# EAGLE schematic yacc1buss (EAGLE 7.5.0)
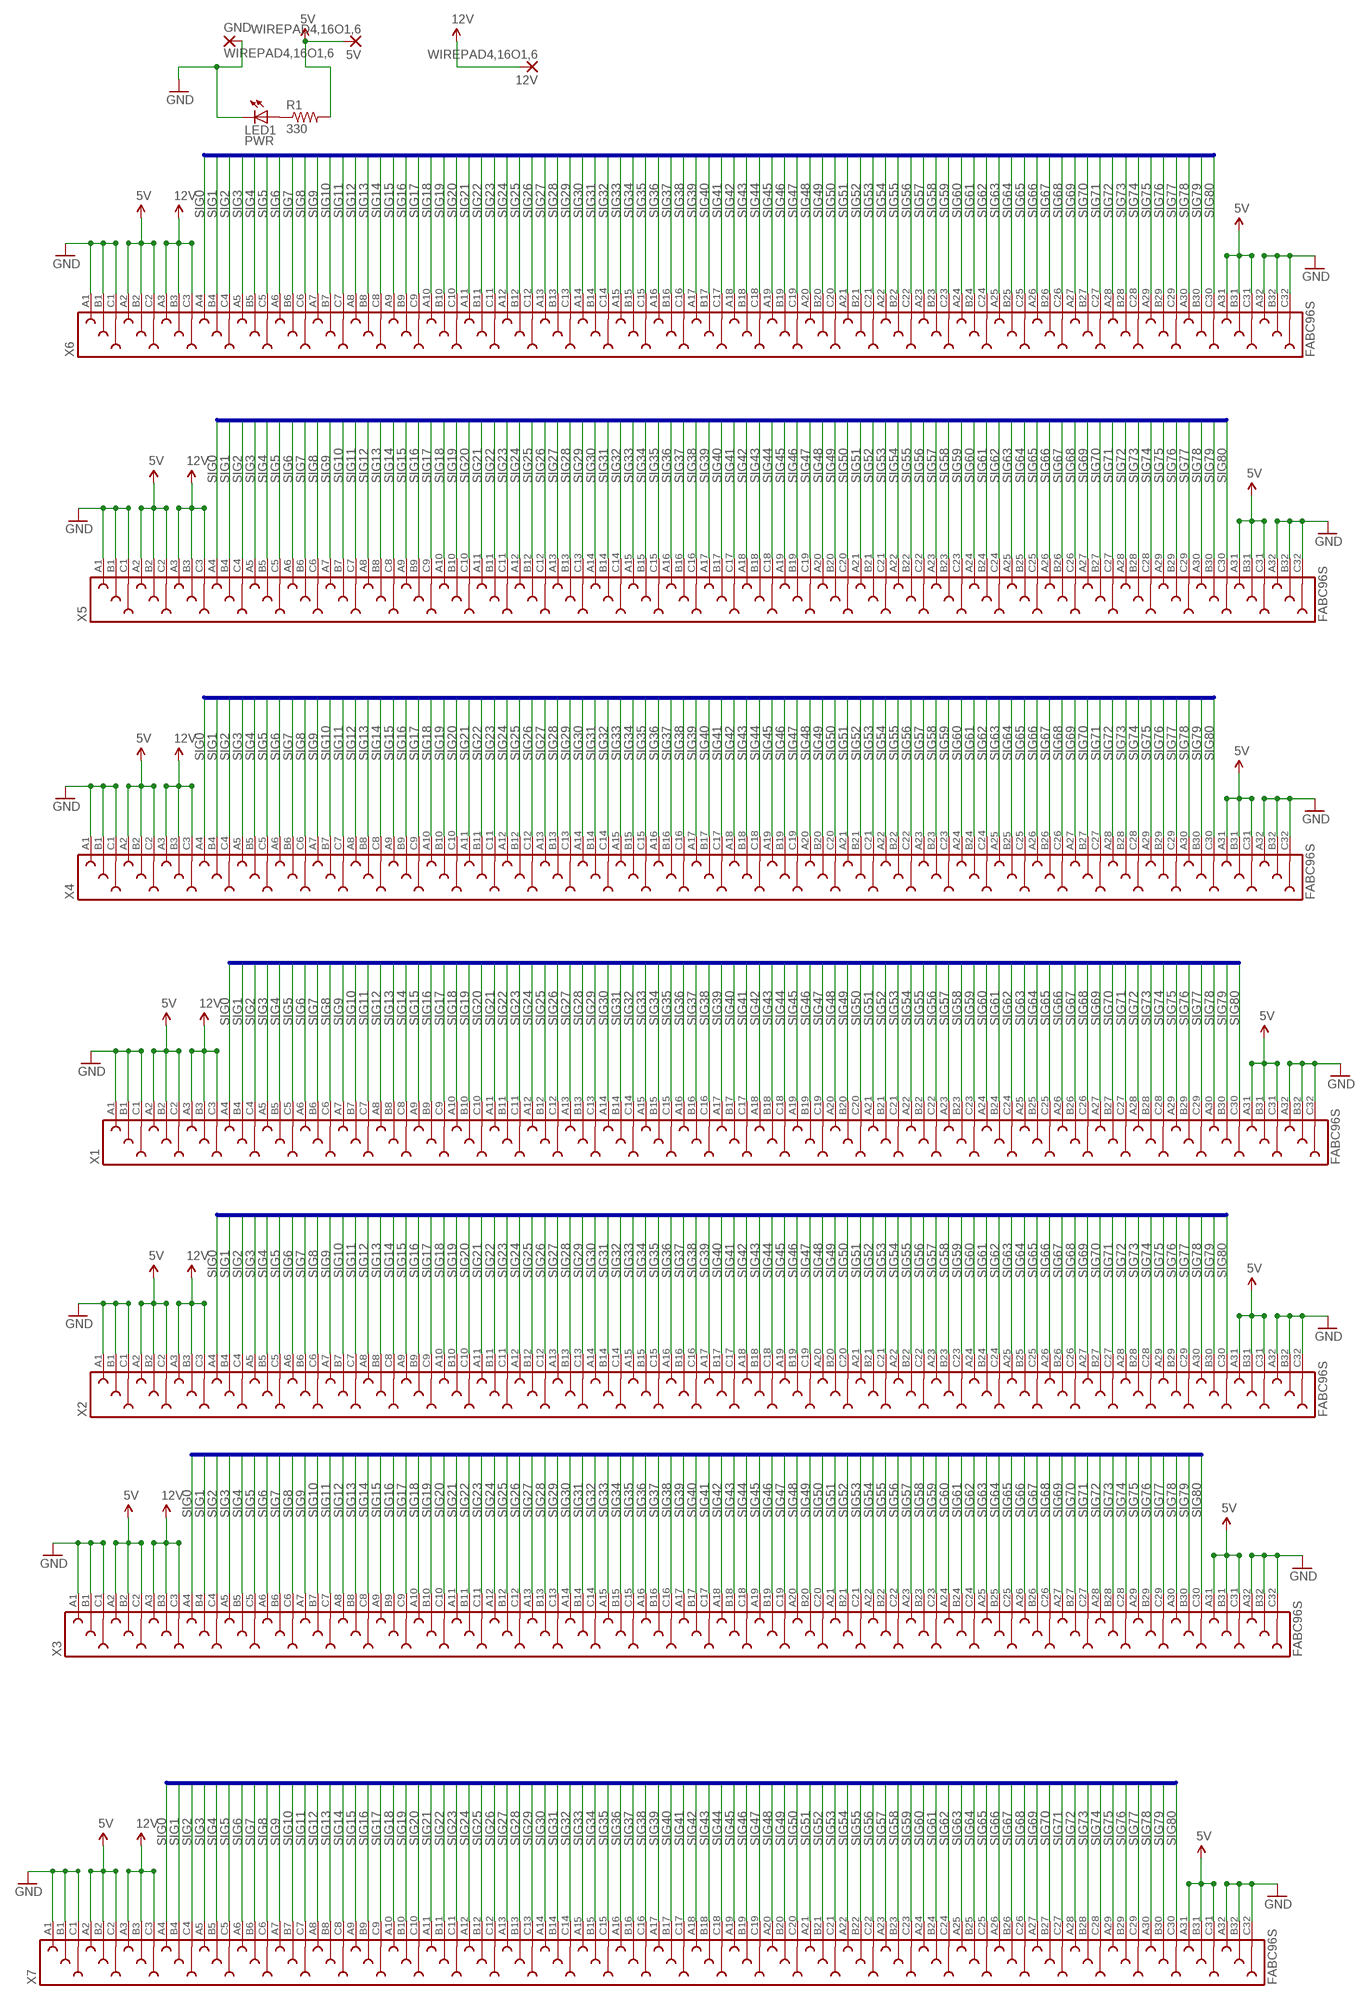
[diagram p0: schematic, sheet 1]

## Parts
5V  WIREPAD4,16O1,6  [4,16O1,6]
12V  WIREPAD4,16O1,6  [4,16O1,6]
GND  WIREPAD4,16O1,6  [4,16O1,6]
LED1  PWR  LED5MM  [LED5MM]
R1  330  R-US_0309/12  [0309/12]
X1  FABC96S  [FABC96S]
X2  FABC96S  [FABC96S]
X3  FABC96S  [FABC96S]
X4  FABC96S  [FABC96S]
X5  FABC96S  [FABC96S]
X6  FABC96S  [FABC96S]
X7  FABC96S  [FABC96S]

## Nets
5V [5V]: 5V.1(P) R1.2 X1.A2 X1.A31 X1.B2 X1.B31 X1.C2 X1.C31 X2.A2 X2.A31 X2.B2 X2.B31 X2.C2 X2.C31 X3.A2 X3.A31 X3.B2 X3.B31 X3.C2 X3.C31 X4.A2 X4.A31 X4.B2 X4.B31 X4.C2 X4.C31 X5.A2 X5.A31 X5.B2 X5.B31 X5.C2 X5.C31 X6.A2 X6.A31 X6.B2 X6.B31 X6.C2 X6.C31 X7.A2 X7.A31 X7.B2 X7.B31 X7.C2 X7.C31
12V [12V]: 12V.1(P) X1.A3 X1.B3 X1.C3 X2.A3 X2.B3 X2.C3 X3.A3 X3.B3 X3.C3 X4.A3 X4.B3 X4.C3 X5.A3 X5.B3 X5.C3 X6.A3 X6.B3 X6.C3 X7.A3 X7.B3 X7.C3
GND [GND]: GND.1(P) LED1.K(C) X1.A1 X1.A32 X1.B1 X1.B32 X1.C1 X1.C32 X2.A1 X2.A32 X2.B1 X2.B32 X2.C1 X2.C32 X3.A1 X3.A32 X3.B1 X3.B32 X3.C1 X3.C32 X4.A1 X4.A32 X4.B1 X4.B32 X4.C1 X4.C32 X5.A1 X5.A32 X5.B1 X5.B32 X5.C1 X5.C32 X6.A1 X6.A32 X6.B1 X6.B32 X6.C1 X6.C32 X7.A1 X7.A32 X7.B1 X7.B32 X7.C1 X7.C32
N$1: LED1.A R1.1
SIG0: X1.A4 X2.A4 X3.A4 X4.A4 X5.A4 X6.A4 X7.A4
SIG1: X1.B4 X2.B4 X3.B4 X4.B4 X5.B4 X6.B4 X7.B4
SIG2: X1.C4 X2.C4 X3.C4 X4.C4 X5.C4 X6.C4 X7.C4
SIG3: X1.A5 X2.A5 X3.A5 X4.A5 X5.A5 X6.A5 X7.A5
SIG4: X1.B5 X2.B5 X3.B5 X4.B5 X5.B5 X6.B5 X7.B5
SIG5: X1.C5 X2.C5 X3.C5 X4.C5 X5.C5 X6.C5 X7.C5
SIG6: X1.A6 X2.A6 X3.A6 X4.A6 X5.A6 X6.A6 X7.A6
SIG7: X1.B6 X2.B6 X3.B6 X4.B6 X5.B6 X6.B6 X7.B6
SIG8: X1.C6 X2.C6 X3.C6 X4.C6 X5.C6 X6.C6 X7.C6
SIG9: X1.A7 X2.A7 X3.A7 X4.A7 X5.A7 X6.A7 X7.A7
SIG10: X1.B7 X2.B7 X3.B7 X4.B7 X5.B7 X6.B7 X7.B7
SIG11: X1.C7 X2.C7 X3.C7 X4.C7 X5.C7 X6.C7 X7.C7
SIG12: X1.A8 X2.A8 X3.A8 X4.A8 X5.A8 X6.A8 X7.A8
SIG13: X1.B8 X2.B8 X3.B8 X4.B8 X5.B8 X6.B8 X7.B8
SIG14: X1.C8 X2.C8 X3.C8 X4.C8 X5.C8 X6.C8 X7.C8
SIG15: X1.A9 X2.A9 X3.A9 X4.A9 X5.A9 X6.A9 X7.A9
SIG16: X1.B9 X2.B9 X3.B9 X4.B9 X5.B9 X6.B9 X7.B9
SIG17: X1.C9 X2.C9 X3.C9 X4.C9 X5.C9 X6.C9 X7.C9
SIG18: X1.A10 X2.A10 X3.A10 X4.A10 X5.A10 X6.A10 X7.A10
SIG19: X1.B10 X2.B10 X3.B10 X4.B10 X5.B10 X6.B10 X7.B10
SIG20: X1.C10 X2.C10 X3.C10 X4.C10 X5.C10 X6.C10 X7.C10
SIG21: X1.A11 X2.A11 X3.A11 X4.A11 X5.A11 X6.A11 X7.A11
SIG22: X1.B11 X2.B11 X3.B11 X4.B11 X5.B11 X6.B11 X7.B11
SIG23: X1.C11 X2.C11 X3.C11 X4.C11 X5.C11 X6.C11 X7.C11
SIG24: X1.A12 X2.A12 X3.A12 X4.A12 X5.A12 X6.A12 X7.A12
SIG25: X1.B12 X2.B12 X3.B12 X4.B12 X5.B12 X6.B12 X7.B12
SIG26: X1.C12 X2.C12 X3.C12 X4.C12 X5.C12 X6.C12 X7.C12
SIG27: X1.A13 X2.A13 X3.A13 X4.A13 X5.A13 X6.A13 X7.A13
SIG28: X1.B13 X2.B13 X3.B13 X4.B13 X5.B13 X6.B13 X7.B13
SIG29: X1.C13 X2.C13 X3.C13 X4.C13 X5.C13 X6.C13 X7.C13
SIG30: X1.A14 X2.A14 X3.A14 X4.A14 X5.A14 X6.A14 X7.A14
SIG31: X1.B14 X2.B14 X3.B14 X4.B14 X5.B14 X6.B14 X7.B14
SIG32: X1.C14 X2.C14 X3.C14 X4.C14 X5.C14 X6.C14 X7.C14
SIG33: X1.A15 X2.A15 X3.A15 X4.A15 X5.A15 X6.A15 X7.A15
SIG34: X1.B15 X2.B15 X3.B15 X4.B15 X5.B15 X6.B15 X7.B15
SIG35: X1.C15 X2.C15 X3.C15 X4.C15 X5.C15 X6.C15 X7.C15
SIG36: X1.A16 X2.A16 X3.A16 X4.A16 X5.A16 X6.A16 X7.A16
SIG37: X1.B16 X2.B16 X3.B16 X4.B16 X5.B16 X6.B16 X7.B16
SIG38: X1.C16 X2.C16 X3.C16 X4.C16 X5.C16 X6.C16 X7.C16
SIG39: X1.A17 X2.A17 X3.A17 X4.A17 X5.A17 X6.A17 X7.A17
SIG40: X1.B17 X2.B17 X3.B17 X4.B17 X5.B17 X6.B17 X7.B17
SIG41: X1.C17 X2.C17 X3.C17 X4.C17 X5.C17 X6.C17 X7.C17
SIG42: X1.A18 X2.A18 X3.A18 X4.A18 X5.A18 X6.A18 X7.A18
SIG43: X1.B18 X2.B18 X3.B18 X4.B18 X5.B18 X6.B18 X7.B18
SIG44: X1.C18 X2.C18 X3.C18 X4.C18 X5.C18 X6.C18 X7.C18
SIG45: X1.A19 X2.A19 X3.A19 X4.A19 X5.A19 X6.A19 X7.A19
SIG46: X1.B19 X2.B19 X3.B19 X4.B19 X5.B19 X6.B19 X7.B19
SIG47: X1.C19 X2.C19 X3.C19 X4.C19 X5.C19 X6.C19 X7.C19
SIG48: X1.A20 X2.A20 X3.A20 X4.A20 X5.A20 X6.A20 X7.A20
SIG49: X1.B20 X2.B20 X3.B20 X4.B20 X5.B20 X6.B20 X7.B20
SIG50: X1.C20 X2.C20 X3.C20 X4.C20 X5.C20 X6.C20 X7.C20
SIG51: X1.A21 X2.A21 X3.A21 X4.A21 X5.A21 X6.A21 X7.A21
SIG52: X1.B21 X2.B21 X3.B21 X4.B21 X5.B21 X6.B21 X7.B21
SIG53: X1.C21 X2.C21 X3.C21 X4.C21 X5.C21 X6.C21 X7.C21
SIG54: X1.A22 X2.A22 X3.A22 X4.A22 X5.A22 X6.A22 X7.A22
SIG55: X1.B22 X2.B22 X3.B22 X4.B22 X5.B22 X6.B22 X7.B22
SIG56: X1.C22 X2.C22 X3.C22 X4.C22 X5.C22 X6.C22 X7.C22
SIG57: X1.A23 X2.A23 X3.A23 X4.A23 X5.A23 X6.A23 X7.A23
SIG58: X1.B23 X2.B23 X3.B23 X4.B23 X5.B23 X6.B23 X7.B23
SIG59: X1.C23 X2.C23 X3.C23 X4.C23 X5.C23 X6.C23 X7.C23
SIG60: X1.A24 X2.A24 X3.A24 X4.A24 X5.A24 X6.A24 X7.A24
SIG61: X1.B24 X2.B24 X3.B24 X4.B24 X5.B24 X6.B24 X7.B24
SIG62: X1.C24 X2.C24 X3.C24 X4.C24 X5.C24 X6.C24 X7.C24
SIG63: X1.A25 X2.A25 X3.A25 X4.A25 X5.A25 X6.A25 X7.A25
SIG64: X1.B25 X2.B25 X3.B25 X4.B25 X5.B25 X6.B25 X7.B25
SIG65: X1.C25 X2.C25 X3.C25 X4.C25 X5.C25 X6.C25 X7.C25
SIG66: X1.A26 X2.A26 X3.A26 X4.A26 X5.A26 X6.A26 X7.A26
SIG67: X1.B26 X2.B26 X3.B26 X4.B26 X5.B26 X6.B26 X7.B26
SIG68: X1.C26 X2.C26 X3.C26 X4.C26 X5.C26 X6.C26 X7.C26
SIG69: X1.A27 X2.A27 X3.A27 X4.A27 X5.A27 X6.A27 X7.A27
SIG70: X1.B27 X2.B27 X3.B27 X4.B27 X5.B27 X6.B27 X7.B27
SIG71: X1.C27 X2.C27 X3.C27 X4.C27 X5.C27 X6.C27 X7.C27
SIG72: X1.A28 X2.A28 X3.A28 X4.A28 X5.A28 X6.A28 X7.A28
SIG73: X1.B28 X2.B28 X3.B28 X4.B28 X5.B28 X6.B28 X7.B28
SIG74: X1.C28 X2.C28 X3.C28 X4.C28 X5.C28 X6.C28 X7.C28
SIG75: X1.A29 X2.A29 X3.A29 X4.A29 X5.A29 X6.A29 X7.A29
SIG76: X1.B29 X2.B29 X3.B29 X4.B29 X5.B29 X6.B29 X7.B29
SIG77: X1.C29 X2.C29 X3.C29 X4.C29 X5.C29 X6.C29 X7.C29
SIG78: X1.A30 X2.A30 X3.A30 X4.A30 X5.A30 X6.A30 X7.A30
SIG79: X1.B30 X2.B30 X3.B30 X4.B30 X5.B30 X6.B30 X7.B30
SIG80: X1.C30 X2.C30 X3.C30 X4.C30 X5.C30 X6.C30 X7.C30

## Buses
SIG[0..80]

## Library data of the parts
5V 12V GND = wirepad:WIREPAD: Wire PAD connect wire on PCB
LED1 = led:LED: LED OSRAM: - CHIPLED LG R971, LG N971, LY N971, LG Q971, LY Q971, LO R971, LY R971 LH N974, LH R974 LS Q976, LO Q976, LY Q976 LO Q996 - Hyper CHIPLED LW Q18S LB Q993, LB Q99A, LB R99A - SideLED LS A670, LO A670, LY A670, LG A670, LP A670 LB A673, LV A673, LT A673, LW A673 LH A674 LY A675 LS A676, LA A676, LO A676, LY A676, LW A676 LS A679, LY A679, LG A679 - Hyper Micro SIDELED® LS Y876, LA Y876, LO Y876, LY Y876 LT Y87S - SmartLED LW L88C, LW L88S LB L89C, LB L89S, LG L890 LS L89K, LO L89K, LY L89K LS L896, LA L896, LO L896, LY L896 - TOPLED LS T670, LO T670, LY T670, LG T670, LP T670 LSG T670, LSP T670, LSY T670, LOP T670, LYG T670 LG T671, LOG T671, LSG T671 LB T673, LV T673, LT T673, LW T673 LH T674 LS T676, LA T676, LO T676, LY T676, LB T676, LH T676, LSB T676, LW T676 LB T67C, LV T67C, LT T67C, LS T67K, LO T67K, LY T67K, LW E67C LS E67B, LA E67B, LO E67B, LY E67B, LB E67C, LV E67C, LT E67C LW T67C LS T679, LY T679, LG T679 LS T770, LO T770, LY T770, LG T770, LP T770 LB T773, LV T773, LT T773, LW T773 LH T774 LS E675, LA E675, LY E675, LS T675 LS T776, LA T776, LO T776, LY T776, LB T776 LHGB T686 LT T68C, LB T68C - Hyper Mini TOPLED® LB M676 - Mini TOPLED Santana® LG M470 LS M47K, LO M47K, LY M47K Source: http://www.osram.convergy.de LUXEON: - LUMILED® LXK2-PW12-R00, LXK2-PW12-S00, LXK2-PW14-U00, LXK2-PW14-V00 LXK2-PM12-R00, LXK2-PM12-S00, LXK2-PM14-U00 LXK2-PE12-Q00, LXK2-PE12-R00, LXK2-PE12-S00, LXK2-PE14-T00, LXK2-PE14-U00 LXK2-PB12-K00, LXK2-PB12-L00, LXK2-PB12-M00, LXK2-PB14-N00, LXK2-PB14-P00, LXK2-PB14-Q00 LXK2-PR12-L00, LXK2-PR12-M00, LXK2-PR14-Q00, LXK2-PR14-R00 LXK2-PD12-Q00, LXK2-PD12-R00, LXK2-PD12-S00 LXK2-PH12-R00, LXK2-PH12-S00 LXK2-PL12-P00, LXK2-PL12-Q00, LXK2-PL12-R00 Source: www.luxeon.com KINGBRIGHT: KA-3528ASYC Source: www.kingbright.com
R1 = resistor:R-US_: RESISTOR, American symbol
X1-X7 = con-vg:FABC96S: CONNECTOR female, 96 pins, block, type C, rows ABC, grid 2.54 mm

## Net classes
1 GND: width 1 mm
2 5V: width 1 mm
3 12V: width 1 mm